# EAGLE design esp dht (EAGLE 7.1.0)
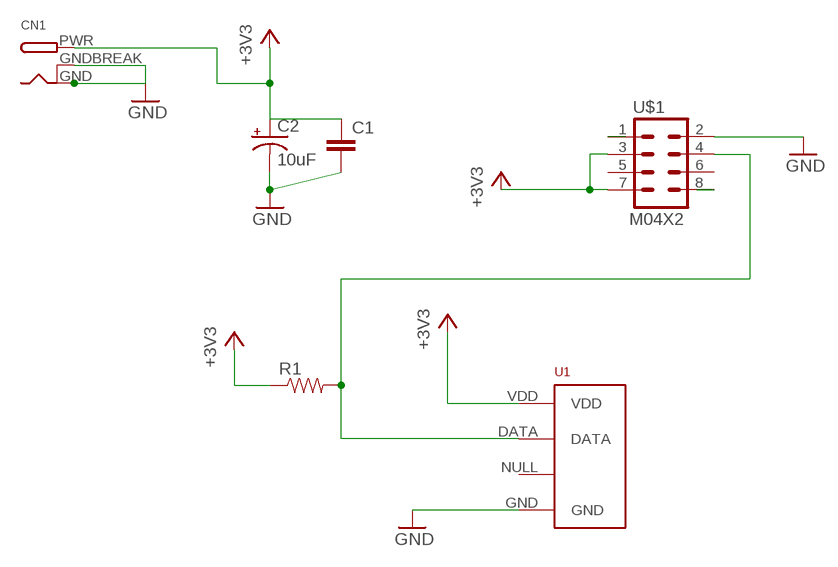
[diagram p0: schematic, sheet 1]

## Parts
C1  CAPPTH  [CAP-PTH-SMALL]
C2  10uF  CAP_POLPTH2  [CPOL-RADIAL-10UF-25V]
CN1  DCBARRELPTH  [DCJACK_2MM_PTH]
R1  RESISTORPTH-1/4W  [AXIAL-0.4]
U1  RHT03_DHT-22_AM2302RA  [RHT03_DHT-22/RA]
U$1  M04X2  [2X4]

## Nets
+3V3: C1.1 C2.1(+) CN1.PWR R1.P$1 U1.VDD U$1.3 U$1.7
GND: C1.2 C2.2(-) CN1.GND CN1.GNDBREAK U1.GND U$1.2
N$1: U$1.8
N$2: R1.P$2 U1.DATA U$1.4
TXL: U$1.1
Unconnected: U1.NULL U$1.5 U$1.6

## Library data of the parts
C1 = SparkFun-Capacitors:CAP: Capacitor Standard 0603 ceramic capacitor, and 0.1" leaded capacitor.
C2 = SparkFun-Capacitors:CAP_POL: Capacitor Polarized These are standard SMD and PTH capacitors. Normally 10uF, 47uF, and 100uF in electrolytic and tantalum varieties. Always verify the external diameter of the through hole cap, it varies with capacity, voltage, and manufacturer. The EIA devices should be standard.
CN1 = adafruit:DCBARREL: 2.0mm DC Barrel Jack DCJACK_2MM_PTH - Through Hole Jack (4UConnector: 05537)
R1 = SparkFun-Resistors:RESISTOR: Resistor Basic schematic elements and footprints for 0603, 1206, and PTH resistors.
U1 = RHT03_DHT-22_AM2302:RHT03_DHT-22_AM2302: RHT03 / DHT-22 / AM2302 Packages and symbol for the RHT03 / DHT-22 relative humidity and temperature sensor. Note: The AM2302 is a wired version of the DHT-22 which typically requires less clearance and is thus provided as a separate package.; PROD_ID: SEN-10167
U$1 = SparkFun-Connectors:M04X2: .1" header, two rows of four.

## Board
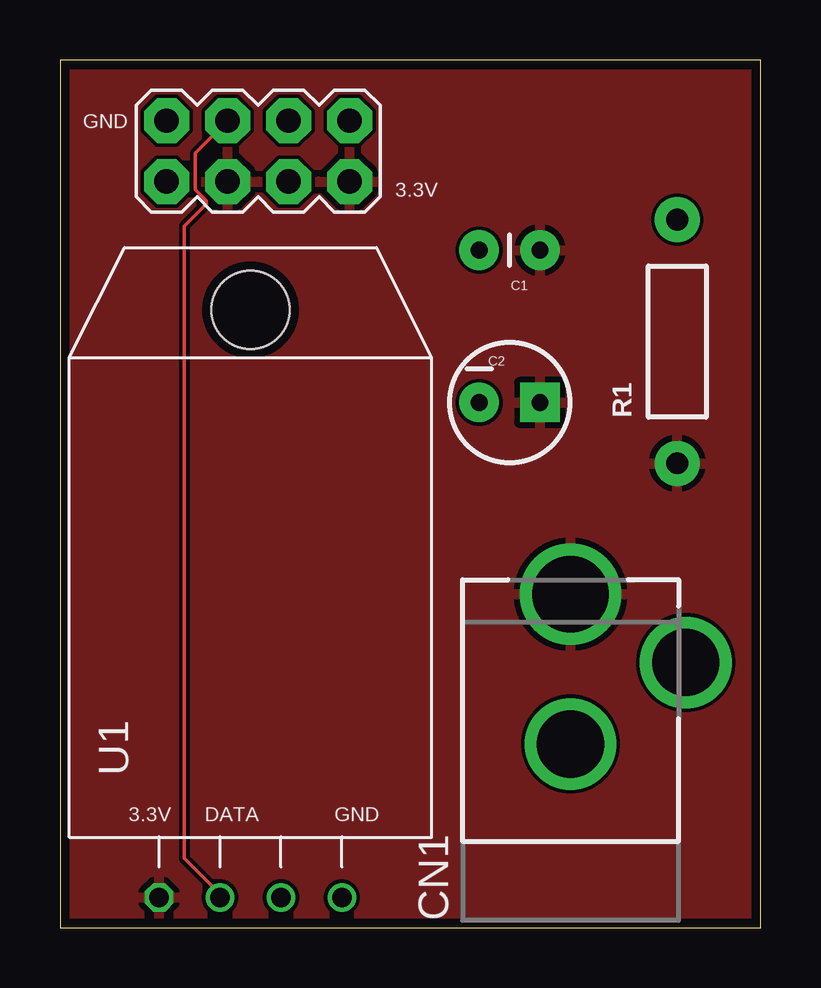
[diagram p1: board, top side]
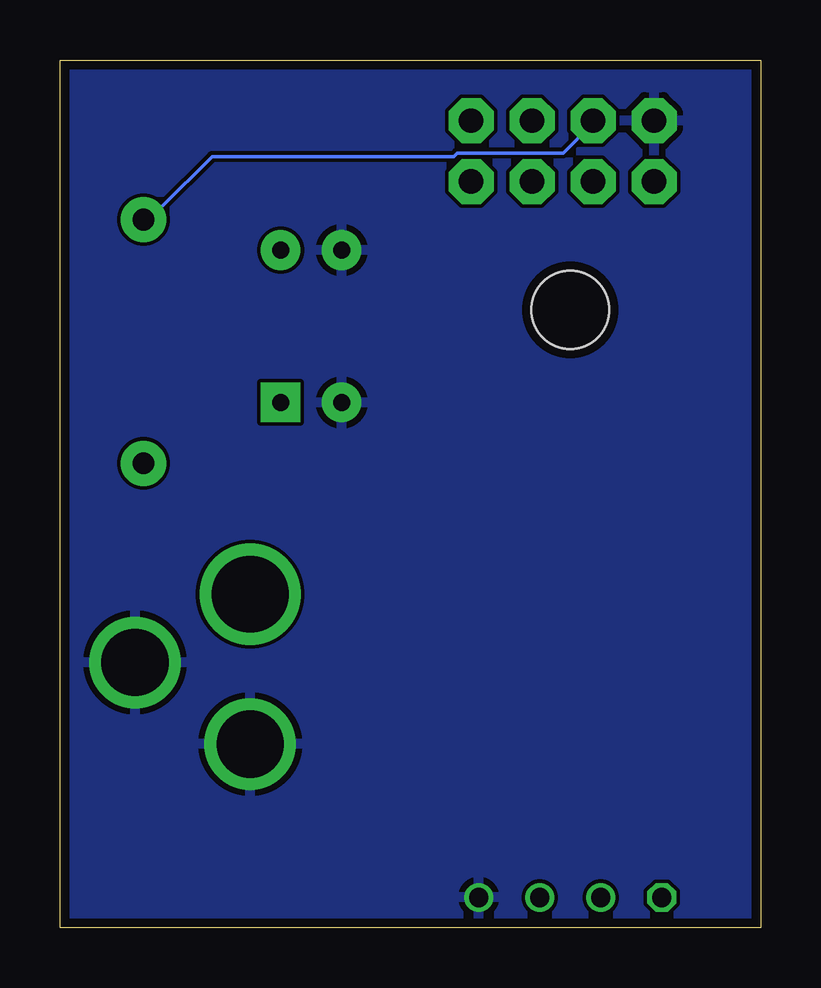
[diagram p2: board, bottom side, seen from below]

Size 29.2 x 36.19 mm. Coordinates in mm from the lower left corner, seen from the top.
Outline: 0,0 29.2,0 29.2,36.19 0,36.19 0,0
Copper layers (1*16): Top 0.0356mm / dielectric 1.5011mm / Bottom 0.0356mm
Design rules "LaenPCBOrder": minimum track width 6mil, minimum drill 13mil, track to track 6mil, track to pad 6mil, pad to pad 6mil, via to via 6mil, smd to smd 6mil, copper to edge 15mil, drill to drill 6mil, minimum pad ring 7mil, minimum via ring 7mil, stop-mask expansion 3mil, vias tented up to drill 0mil, thermal gap 10mil

### Footprints (pad centres in the part's own frame; a part is rotated, then mirrored left to right if it is on the bottom)
CAP-PTH-SMALL = drill 0.7 pad 1.651: 1 0,0; 2 2.54,0
CPOL-RADIAL-10UF-25V = drill 0.7 pad 1.651 square: 1 1.27,0 | drill 0.7 pad 1.651: 2 -1.27,0
DCJACK_2MM_PTH = drill 2.8: GND 0,7.35; GNDBREAK 4.8,10.75 | drill 3.2: PWR 0,13.6
AXIAL-0.4 = drill 0.9 pad 1.88: P$1 -5.08,0; P$2 5.08,0
RHT03_DHT-22/RA = drill 0.8: DATA -1.27,0; GND 3.81,0; NULL 1.27,0 | drill 0.8 octagon: VDD -3.81,0 | hole 3.25: 0,24.5
2X4 = drill 1.016 pad 1.88 octagon: 1 -3.81,-1.27; 2 -3.81,1.27; 3 -1.27,-1.27; 4 -1.27,1.27; 5 1.27,-1.27; 6 1.27,1.27; 7 3.81,-1.27; 8 3.81,1.27

### Placement (x,y rotation side)
C1  20,28.26 180 top
C2  18.73,21.91 0 top
CN1  21.27,0.32 0 top
R1  25.72,24.45 90 top
U1  7.94,1.27 0 top
U$1  8.26,32.38 0 top

### Tracks (layer width: path | path; a pad name or v marks a point on that pad's centre or on a via)
+3V3
  pour Top: -1.91,37.78 37.47,36.51 33.66,-0.95 -4.76,-3.17
GND
  pour Bottom: -3.49,41.91 35.88,39.05 37.15,-2.22 -1.27,-0.64 -1.27,0.64
N$2
  Top 0.152: U$1.4 5.64,32.31 5.64,30.79 6.1,30.33 6.1,30.18 5.18,29.26 5.18,2.9 6.55,1.52 6.55,1.37 U1.DATA
  Bottom 0.152: R1.P$2 25.6,29.57 25.15,30.02 24.99,30.02 22.86,32.16 12.8,32.16 12.65,32.31 8.23,32.31 7.01,33.53 U$1.4

### Text on the board
tNames: GND | 3.3V | 3.3V | DATA | GND